# Altium schematic sheet BLDC-CONNECTORS.SchDoc
size 594 x 420 mm; DocumentNumber: АБВГ.000000.000 Э3; SheetNumber: 5; PageSetup: Record=PageOptions|CenterHorizontal=False|CenterVertical=False|PrintScale=0.95|XCorrection=0.00|YCorrection=0.00|PrintKind=1|BorderSize=5000000|LeftOffset=0|BottomOffset=0|Orientation=1|PaperLength=1000|PaperWidth=1000|Scale=100|PaperSource=15|PrintQuality=600|MediaType=1|DitherType=10|PaperKind=A4|PrintScaleMode=1; Letter1Column: {}; Letter2Column: {}; Letter3Column: {}; ProcessInspection: ProcessInspection; EngineerName: EngineerName; NormInspection: NormInspection; DocumentType: DocumentType; Mass: Mass; Scale: Scale; Developer1size1str: Developer1size1str; Developer2size1str: Developer2size1str; Developer2size2str: Developer2size2str; Title1size1str: Title1size1str; Title2size1str: Title2size1str; Title2size2str: Title2size2str; Title3size3str: Title3size3str; Title3size2str: Title3size2str; Title3size1str: Title3size1str; FunctionalGroup: #_
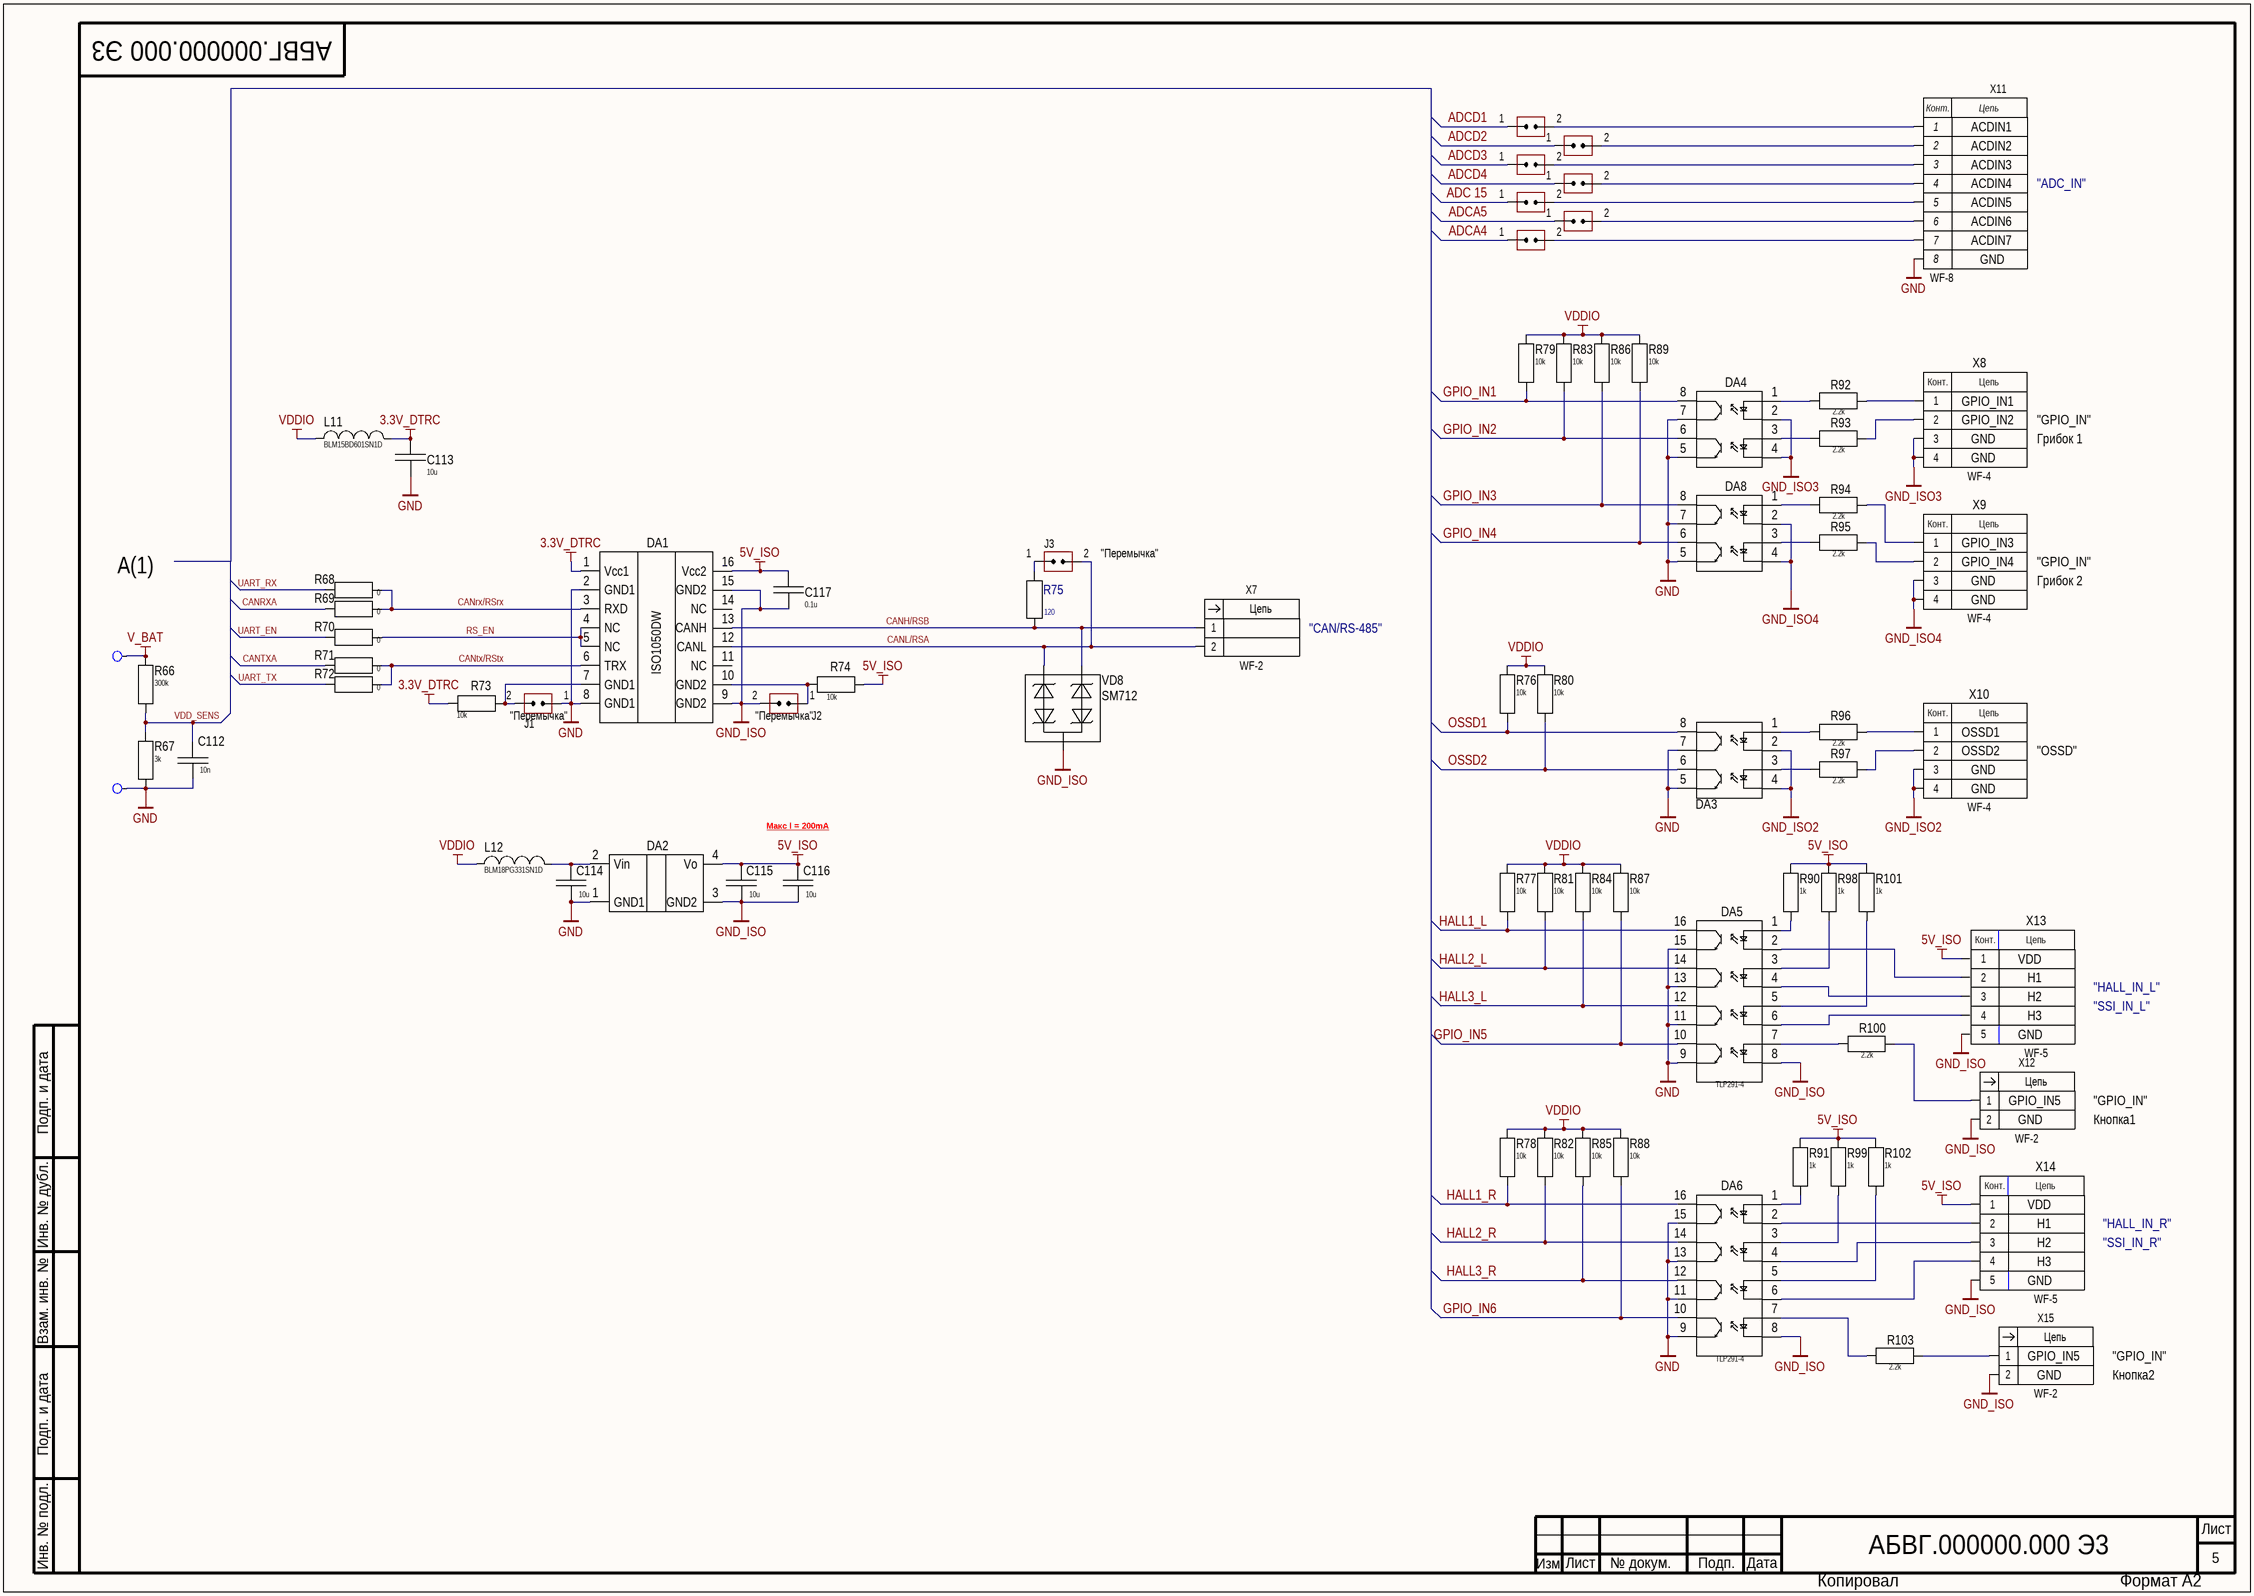
[diagram p0: BLDC-CONNECTORS.SchDoc]

## Parts
C112  10n  [CAP: 0402]
C113  10u  [CAP: 0402]
C114  10u  [CAP: 0402]
C115  10u  [CAP: 0402]
C116  10u  [CAP: 0402]
C117  0.1u  [CAP: 0402]
DA1  ISO1050DW  [SOIC-16-300-1.27]
DA2  ROE-3.305S  [ROE-3.305S]  (value not drawn)
DA3  MOCD207R2M  [8-SOIC]  (value not drawn)
DA4  MOCD207R2M  [8-SOIC]  (value not drawn)
DA5  TLP291-4  [16-SO]
DA6  TLP291-4  [16-SO]
DA8  MOCD207R2M  [8-SOIC]  (value not drawn)
J1  CommentText: "Перемычка"  [CON: JUMPER x1]
J2  CommentText: "Перемычка"  [CON: JUMPER x1]
J3  CommentText: "Перемычка"  [CON: JUMPER x1]
J4  (no value)  [CON: JUMPER x1]
J5  (no value)  [CON: JUMPER x1]
J6  (no value)  [CON: JUMPER x1]
J7  (no value)  [CON: JUMPER x1]
J8  (no value)  [CON: JUMPER x1]
J9  (no value)  [CON: JUMPER x1]
J10  (no value)  [CON: JUMPER x1]
L11  BLM15BD601SN1D  [IND: 0402]
L12  BLM18PG331SN1D  [IND: 0603]
R66  300k  [RES: 0402]
R67  3k  [RES: 0402]
R68  0  [RES: 0402]
R69  0  [RES: 0402]
R70  0  [RES: 0402]
R71  0  [RES: 0402]
R72  0  [RES: 0402]
R73  10k  [RES: 0402]
R74  10k  [RES: 0402]
R75  120  [RES: 0603]
R76  10k  [RES: 0402]
R77  10k  [RES: 0402]
R78  10k  [RES: 0402]
R79  10k  [RES: 0402]
R80  10k  [RES: 0402]
R81  10k  [RES: 0402]
R82  10k  [RES: 0402]
R83  10k  [RES: 0402]
R84  10k  [RES: 0402]
R85  10k  [RES: 0402]
R86  10k  [RES: 0402]
R87  10k  [RES: 0402]
R88  10k  [RES: 0402]
R89  10k  [RES: 0402]
R90  1k  [RES: 0402]
R91  1k  [RES: 0402]
R92  2.2k  [RES: 0402]
R93  2.2k  [RES: 0402]
R94  2.2k  [RES: 0402]
R95  2.2k  [RES: 0402]
R96  2.2k  [RES: 0402]
R97  2.2k  [RES: 0402]
R98  1k  [RES: 0402]
R99  1k  [RES: 0402]
R100  2.2k  [RES: 0402]
R101  1k  [RES: 0402]
R102  1k  [RES: 0402]
R103  2.2k  [RES: 0402]
T1  TestPoint PWR  [CON: DJ617-6.3 (TA-MR1)]  (value not drawn)
T2  TestPoint PWR  [CON: DJ617-6.3 (TA-MR1)]  (value not drawn)
VD8  SM712  [SOT-23-3]
X7  WF-2  [WF-2]
X8  WF-4  [WF-4]
X9  WF-4  [WF-4]
X10  WF-4  [WF-4]
X11  WF-8  [WF-8]
X12  WF-2  [WF-2]
X13  WF-5  [WF-5]
X14  WF-5  [WF-5]
X15  WF-2  [WF-2]

## Nets
3.3V_DTRC: C113.2 DA1.1(Vcc1) L11.1 R73.1
5V_ISO: C115.2 C116.2 C117.2 DA1.16(Vcc2) DA2.4(Vo) R74.2 R90.1 R91.1 R98.1 R99.1 R101.1 R102.1 X13.1 X14.1
GND: C112.1 C113.1 C114.1 DA1.2(GND1) DA1.8(GND1) DA2.1(GND1) DA3.5(Vo1) DA3.7(Vo1) DA4.5(Vo1) DA4.7(Vo1) DA5.9(Vo1) DA5.11(Vo1) DA5.13(Vo1) DA5.15(Vo1) DA6.9(Vo1) DA6.11(Vo1) DA6.13(Vo1) DA6.15(Vo1) DA8.5(Vo1) DA8.7(Vo1) J1.1(IN) R67.2 T2.1(T) X11.8
GND_ISO: C115.1 C116.1 C117.1 DA1.9(GND2) DA1.15(GND2) DA2.3(GND2) DA5.8(C1) DA6.8(C1) J2.2(IN) VD8.3 X12.2 X13.5 X14.5 X15.2
GND_ISO2: DA3.2(C1) DA3.4(C1) X10.3 X10.4
GND_ISO3: DA4.2(C1) DA4.4(C1) X8.3 X8.4
GND_ISO4: DA8.2(C1) DA8.4(C1) X9.3 X9.4
V_BAT: R66.1 T1.1(T)
VDDIO: L11.2 L12.1 R76.1 R77.1 R78.1 R79.1 R80.1 R81.1 R82.1 R83.1 R84.1 R85.1 R86.1 R87.1 R88.1 R89.1
ADC 15: J6.1(IN)
ADCA4: J7.1(IN)
ADCA5: J10.1(IN)
ADCD1: J4.1(IN)
ADCD2: J8.1(IN)
ADCD3: J5.1(IN)
ADCD4: J9.1(IN)
CANH/RSB: DA1.13(CANH) R75.1 VD8.1 X7.1
CANL/RSA: DA1.12(CANL) J3.2(IN) VD8.2 X7.2
CANrx/RSrx: DA1.3(RXD) R68.2 R69.2
CANRXA: R69.1
CANtx/RStx: DA1.6(TRX) R71.2 R72.2
CANTXA: R71.1
GPIO_IN1: DA4.8(Vdd) R79.2
GPIO_IN2: DA4.6(Vdd) R83.2
GPIO_IN3: DA8.8(Vdd) R86.2
GPIO_IN4: DA8.6(Vdd) R89.2
GPIO_IN5: DA5.10(Vdd) R87.2
GPIO_IN6: DA6.10(Vdd) R88.2
HALL1_L: DA5.16(Vdd) R77.2
HALL1_R: DA6.16(Vdd) R78.2
HALL2_L: DA5.14(Vdd) R81.2
HALL2_R: DA6.14(Vdd) R82.2
HALL3_L: DA5.12(Vdd) R84.2
HALL3_R: DA6.12(Vdd) R85.2
OSSD1: DA3.8(Vdd) R76.2
OSSD2: DA3.6(Vdd) R80.2
RS_EN: DA1.4(NC) DA1.5(NC) R70.2
UART_EN: R70.1
UART_RX: R68.1
UART_TX: R72.1
VDD_SENS: C112.2 R66.2 R67.1
NetC114_2: C114.2 DA2.2(Vin) L12.2
NetDA1_7: DA1.7(GND1) J1.2(IN) R73.2
NetDA1_10: DA1.10(GND2) J2.1(IN) R74.1
NetDA3_1: DA3.1(A1) R96.1
NetDA3_3: DA3.3(A1) R97.1
NetDA4_1: DA4.1(A1) R92.1
NetDA4_3: DA4.3(A1) R93.1
NetDA5_1: DA5.1(A1) R90.2
NetDA5_2: DA5.2(C1) X13.2
NetDA5_3: DA5.3(A1) R98.2
NetDA5_4: DA5.4(C1) X13.3
NetDA5_5: DA5.5(A1) R101.2
NetDA5_6: DA5.6(C1) X13.4
NetDA5_7: DA5.7(A1) R100.1
NetDA6_1: DA6.1(A1) R91.2
NetDA6_2: DA6.2(C1) X14.2
NetDA6_3: DA6.3(A1) R99.2
NetDA6_4: DA6.4(C1) X14.3
NetDA6_5: DA6.5(A1) R102.2
NetDA6_6: DA6.6(C1) X14.4
NetDA6_7: DA6.7(A1) R103.1
NetDA8_1: DA8.1(A1) R94.1
NetDA8_3: DA8.3(A1) R95.1
NetJ3_1: J3.1(IN) R75.2
NetJ4_2: J4.2(IN) X11.1
NetJ5_2: J5.2(IN) X11.3
NetJ6_2: J6.2(IN) X11.5
NetJ7_2: J7.2(IN) X11.7
NetJ8_2: J8.2(IN) X11.2
NetJ9_2: J9.2(IN) X11.4
NetJ10_2: J10.2(IN) X11.6
NetR92_2: R92.2 X8.1
NetR93_2: R93.2 X8.2
NetR94_2: R94.2 X9.1
NetR95_2: R95.2 X9.2
NetR96_2: R96.2 X10.1
NetR97_2: R97.2 X10.2
NetR100_2: R100.2 X12.1
NetR103_2: R103.2 X15.1

Not connected (* = marked no-connect by the designer): DA1 11(NC) 14(NC)

## Notes on the sheet
- ACDIN3
- ACDIN2
- ACDIN1
- ACDIN5
- ACDIN4
- "ADC_IN"
- ACDIN7
- ACDIN6
- GND
- (near X8) GPIO_IN1
- (near X8) GPIO_IN2
- "GPIO_IN"
- Грибок 1
- (near X9) GPIO_IN3
- А(1)
- (near X9) GPIO_IN4
- Грибок 2
- "CAN/RS-485"
- (near X10) OSSD1
- (near X10) OSSD2
- "OSSD"
- Макс I = 200mA
- VDD
- H1
- H2
- H3
- "HALL_IN_L"
- "SSI_IN_L"
- (near X12) GPIO_IN5
- Кнопка1
- "HALL_IN_R"
- "SSI_IN_R"
- (near X15) GPIO_IN5
- Кнопка2
- Подп. и дата
- Инв. № дубл.
- Взам. инв. №
- Инв. № подл.
- Лист
- Изм
- № докум.
- Подп.
- Дата
- Копировал
- Формат А2
- (in symbol WF-2) Цепь
- (in symbol WF-4_T) Конт.; Цепь
- (in symbol WF-5) Конт.; Цепь
- (in symbol WF-8) Конт.; Цепь

## Library data of the parts
C112 C117 = CAP 0402: PartNumber: C0402C104K8PAC; Manufacturer: Kemet; Voltage: 10V; Type: Capacitor; Temperature_Range: -55/+85; Tolerance: 10%; Case: 0402
  C112: Value: 10n
  C117: Value: 0.1u
C113-C116 = CAP 0402: PartNumber: CC0402MRX5R5BB106; Voltage: 6.3V; Value: 10u
DA1 = ISO1050DW: Isolated CAN Trcvr 5kV RMS; PartNumber: ISO1050DW
DA2 = ROE-3.305S: Isol DC/DC 3 to 5V 0.2A; PartNumber: TSR 1; Vin: *
DA5 DA6 = TLP291-4(GB.E): PartNumber: TLP291-4(GB.E)
J1-J3 = Jumper_single
J4-J10 = Jumper_single: CommentText: "Перемычка"
R66-R74 R76-R103 = RES 0402: Tolerance: 1%; PartNumber: *
  R66: Value: 300k
  R67: Value: 3k
  R68-R72: Value: 0
  R73 R74 R76-R89: Value: 10k
  R90 R91 R98 R99 R101 R102: Value: 1k
  R92-R97 R100 R103: Value: 2.2k
R75 = RES 0603: PartNumber: CRCW0603120RFKEAHP; Value: 120
VD8 = SM712: PartNumber: SM712-02HTG
X7 X12 X15 = WF-2: PartNumber: Вилка WF-2 «Zhenqin»; Value: *
X8-X10 = WF-4_T: Value: *
X11 = WF-8: PartNumber: Вилка WF-8 «Zhenqin»; Value: *
X13 X14 = WF-5: PartNumber: Вилка WF-5 «Zhenqin»; Value: *
DA3 DA4 DA8 = MOCD207R2M: PartNumber: MOCD207R2M
L11 = BLM15BD601SN1D: PartNumber: BLM15BD601SN1D
L12 = BLM18PG331SN1D: PartNumber: BLM18PG331SN1D